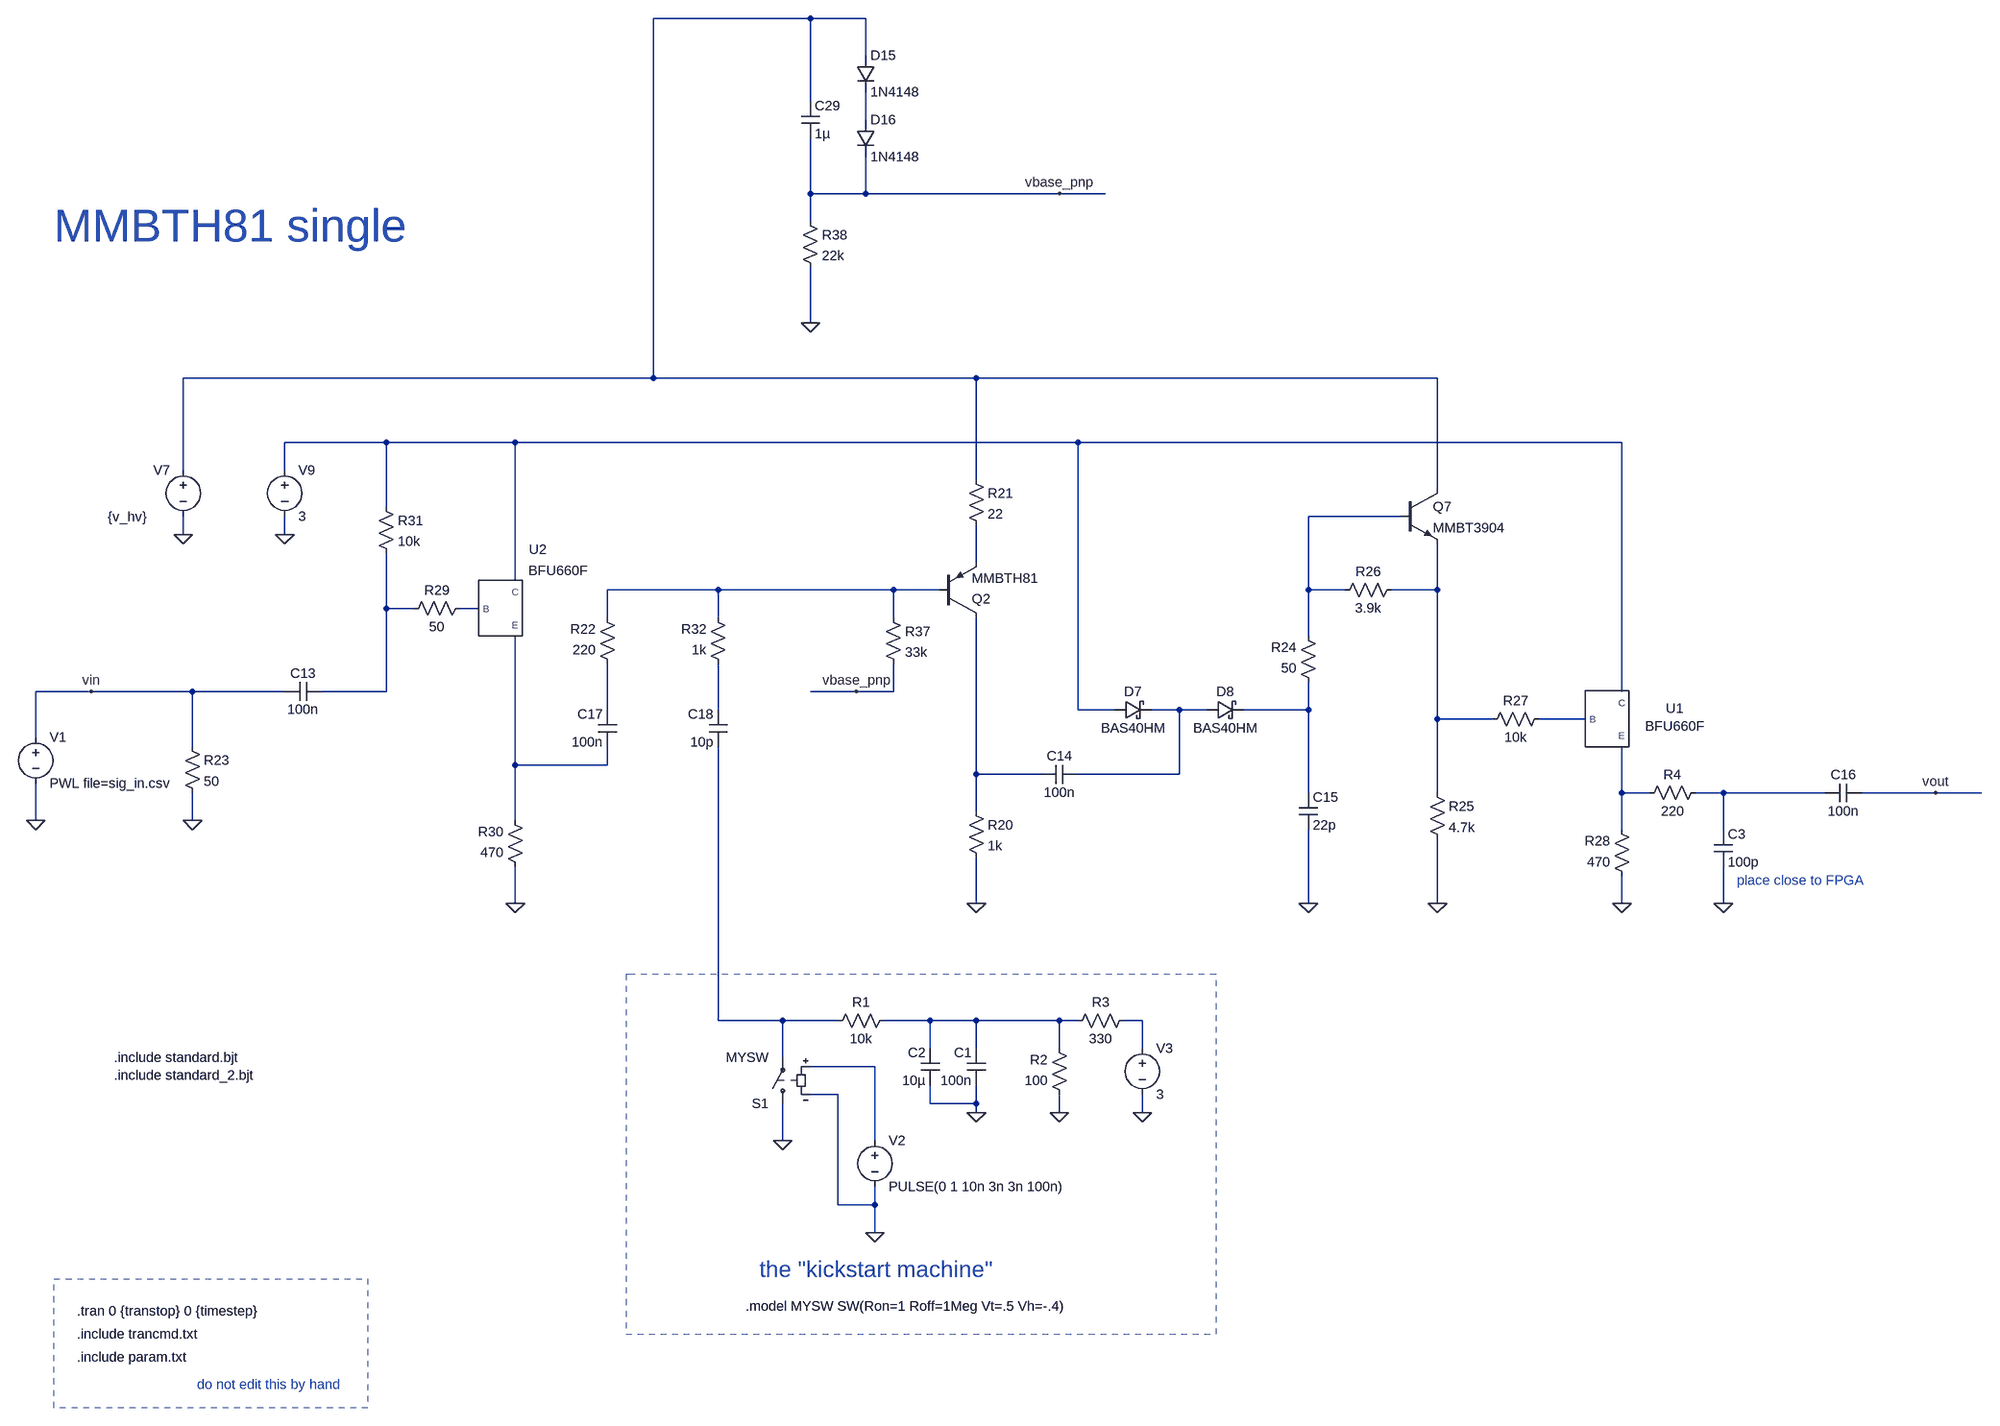
[diagram p0: schematic h81_kickstart_morelinear.asc]
h81_kickstart_morelinear.asc, the LTspice schematic file:
Version 4
SHEET 1 25452 10420
WIRE 19504 5040 19232 5040
WIRE 19600 5040 19504 5040
WIRE 19600 5104 19600 5040
WIRE 19504 5184 19504 5040
WIRE 19600 5216 19600 5168
WIRE 19504 5344 19504 5248
WIRE 19600 5344 19600 5280
WIRE 19600 5344 19504 5344
WIRE 19936 5344 19600 5344
WIRE 20016 5344 19936 5344
WIRE 19504 5392 19504 5344
WIRE 19504 5568 19504 5472
WIRE 19232 5664 19232 5040
WIRE 19232 5664 18416 5664
WIRE 19792 5664 19232 5664
WIRE 20592 5664 19792 5664
WIRE 18768 5776 18592 5776
WIRE 18992 5776 18768 5776
WIRE 19968 5776 18992 5776
WIRE 20912 5776 19968 5776
WIRE 18416 5824 18416 5664
WIRE 18592 5824 18592 5776
WIRE 19792 5840 19792 5664
WIRE 20592 5856 20592 5664
WIRE 18768 5888 18768 5776
WIRE 20528 5904 20368 5904
WIRE 18416 5936 18416 5904
WIRE 18592 5936 18592 5904
WIRE 19792 5984 19792 5920
WIRE 18992 6016 18992 5776
WIRE 19344 6032 19152 6032
WIRE 19648 6032 19344 6032
WIRE 19728 6032 19648 6032
WIRE 20368 6032 20368 5904
WIRE 20432 6032 20368 6032
WIRE 20592 6032 20592 5952
WIRE 20592 6032 20512 6032
WIRE 18768 6064 18768 5968
WIRE 18816 6064 18768 6064
WIRE 18928 6064 18896 6064
WIRE 19152 6080 19152 6032
WIRE 19344 6080 19344 6032
WIRE 19648 6080 19648 6032
WIRE 20368 6112 20368 6032
WIRE 18256 6208 18160 6208
WIRE 18432 6208 18256 6208
WIRE 18592 6208 18432 6208
WIRE 18768 6208 18768 6064
WIRE 18768 6208 18656 6208
WIRE 19584 6208 19504 6208
WIRE 19648 6208 19648 6160
WIRE 19648 6208 19584 6208
WIRE 20912 6208 20912 5776
WIRE 19152 6240 19152 6160
WIRE 19344 6240 19344 6160
WIRE 19968 6240 19968 5776
WIRE 20032 6240 19968 6240
WIRE 20144 6240 20096 6240
WIRE 20192 6240 20144 6240
WIRE 20368 6240 20368 6192
WIRE 20368 6240 20256 6240
WIRE 20592 6256 20592 6032
WIRE 20688 6256 20592 6256
WIRE 20848 6256 20768 6256
WIRE 18160 6288 18160 6208
WIRE 18432 6304 18432 6208
WIRE 18992 6336 18992 6112
WIRE 19152 6336 19152 6304
WIRE 19152 6336 18992 6336
WIRE 19792 6352 19792 6080
WIRE 19904 6352 19792 6352
WIRE 20144 6352 20144 6240
WIRE 20144 6352 19968 6352
WIRE 20368 6384 20368 6240
WIRE 20592 6384 20592 6256
WIRE 20912 6384 20912 6304
WIRE 20960 6384 20912 6384
WIRE 21088 6384 21040 6384
WIRE 21264 6384 21088 6384
WIRE 21456 6384 21328 6384
WIRE 21536 6384 21456 6384
WIRE 19792 6416 19792 6352
WIRE 18160 6432 18160 6368
WIRE 18432 6432 18432 6384
WIRE 18992 6432 18992 6336
WIRE 20912 6448 20912 6384
WIRE 21088 6448 21088 6384
WIRE 18992 6576 18992 6512
WIRE 19792 6576 19792 6496
WIRE 20368 6576 20368 6448
WIRE 20592 6576 20592 6464
WIRE 20912 6576 20912 6528
WIRE 21088 6576 21088 6512
WIRE 19344 6816 19344 6304
WIRE 19456 6816 19344 6816
WIRE 19552 6816 19456 6816
WIRE 19712 6816 19632 6816
WIRE 19792 6816 19712 6816
WIRE 19936 6816 19792 6816
WIRE 19968 6816 19936 6816
WIRE 20080 6816 20048 6816
WIRE 19712 6864 19712 6816
WIRE 19792 6864 19792 6816
WIRE 19936 6864 19936 6816
WIRE 20080 6864 20080 6816
WIRE 19456 6880 19456 6816
WIRE 19616 6896 19504 6896
WIRE 19552 6944 19504 6944
WIRE 19712 6960 19712 6928
WIRE 19792 6960 19792 6928
WIRE 19792 6960 19712 6960
WIRE 19792 6976 19792 6960
WIRE 19936 6976 19936 6944
WIRE 20080 6976 20080 6944
WIRE 19456 7024 19456 6960
WIRE 19616 7024 19616 6896
WIRE 19552 7136 19552 6944
WIRE 19616 7136 19616 7104
WIRE 19616 7136 19552 7136
WIRE 19616 7184 19616 7136
FLAG 19792 6576 0
FLAG 18432 6432 0
FLAG 20368 6576 0
FLAG 20592 6576 0
FLAG 20912 6576 0
FLAG 18592 5936 0
FLAG 18992 6576 0
FLAG 18416 5936 0
FLAG 19504 5568 0
FLAG 18256 6208 vin
FLAG 18160 6432 0
FLAG 21456 6384 vout
FLAG 19456 7024 0
FLAG 19616 7184 0
FLAG 20080 6976 0
FLAG 19936 6976 0
FLAG 19792 6976 0
FLAG 19584 6208 vbase_pnp
FLAG 19936 5344 vbase_pnp
FLAG 21088 6576 0
SYMBOL pnp 19728 6080 M180
SYMATTR InstName Q2
SYMATTR Value MMBTH81
SYMBOL res 19776 6400 R0
SYMATTR InstName R20
SYMATTR Value 1k
SYMBOL res 19776 5824 R0
SYMATTR InstName R21
SYMATTR Value 22
SYMBOL voltage 18416 5808 R0
WINDOW 123 0 0 Left 2
WINDOW 39 14 99 Left 2
WINDOW 0 -52 16 Left 2
WINDOW 3 -131 97 Left 2
SYMATTR InstName V7
SYMATTR Value {v_hv}
SYMBOL res 19168 6176 R180
WINDOW 0 36 76 Left 2
WINDOW 3 36 40 Left 2
SYMATTR InstName R22
SYMATTR Value 220
SYMBOL res 18416 6288 R0
SYMATTR InstName R23
SYMATTR Value 50
SYMBOL cap 18656 6192 R90
WINDOW 0 0 32 VBottom 2
WINDOW 3 32 32 VTop 2
SYMATTR InstName C13
SYMATTR Value 100n
SYMBOL cap 19968 6336 R90
WINDOW 0 0 32 VBottom 2
WINDOW 3 32 32 VTop 2
SYMATTR InstName C14
SYMATTR Value 100n
SYMBOL cap 20352 6384 R0
SYMATTR InstName C15
SYMATTR Value 22p
SYMBOL schottky 20032 6256 R270
WINDOW 3 0 32 VBottom 2
WINDOW 0 32 32 VTop 2
SYMATTR Value BAS40HM
SYMATTR InstName D7
SYMATTR Description Diode
SYMATTR Type diode
SYMBOL schottky 20192 6256 R270
WINDOW 3 0 32 VBottom 2
WINDOW 0 32 32 VTop 2
SYMATTR Value BAS40HM
SYMATTR InstName D8
SYMATTR Description Diode
SYMATTR Type diode
SYMBOL res 20384 6208 R180
WINDOW 0 36 76 Left 2
WINDOW 3 36 40 Left 2
SYMATTR InstName R24
SYMATTR Value 50
SYMBOL res 20576 6368 R0
SYMATTR InstName R25
SYMATTR Value 4.7k
SYMBOL npn 20528 5856 R0
SYMATTR InstName Q7
SYMATTR Value MMBT3904
SYMBOL res 20528 6016 R90
WINDOW 0 0 56 VBottom 2
WINDOW 3 32 56 VTop 2
SYMATTR InstName R26
SYMATTR Value 3.9k
SYMBOL res 20784 6240 R90
WINDOW 0 0 56 VBottom 2
WINDOW 3 32 56 VTop 2
SYMATTR InstName R27
SYMATTR Value 10k
SYMBOL res 20928 6544 R180
WINDOW 0 36 76 Left 2
WINDOW 3 36 40 Left 2
SYMATTR InstName R28
SYMATTR Value 470
SYMBOL cap 21328 6368 R90
WINDOW 0 0 32 VBottom 2
WINDOW 3 32 32 VTop 2
SYMATTR InstName C16
SYMATTR Value 100n
SYMBOL res 18912 6048 R90
WINDOW 0 0 56 VBottom 2
WINDOW 3 32 56 VTop 2
SYMATTR InstName R29
SYMATTR Value 50
SYMBOL res 19008 6528 R180
WINDOW 0 36 76 Left 2
WINDOW 3 36 40 Left 2
SYMATTR InstName R30
SYMATTR Value 470
SYMBOL voltage 18592 5808 R0
SYMATTR InstName V9
SYMATTR Value 3
SYMBOL cap 19168 6304 R180
WINDOW 0 24 56 Left 2
WINDOW 3 24 8 Left 2
SYMATTR InstName C17
SYMATTR Value 100n
SYMBOL res 18752 5872 R0
SYMATTR InstName R31
SYMATTR Value 10k
SYMBOL res 19360 6176 R180
WINDOW 0 36 76 Left 2
WINDOW 3 36 40 Left 2
SYMATTR InstName R32
SYMATTR Value 1k
SYMBOL cap 19360 6304 R180
WINDOW 0 24 56 Left 2
WINDOW 3 24 8 Left 2
SYMATTR InstName C18
SYMATTR Value 10p
SYMBOL res 19632 6064 R0
SYMATTR InstName R37
SYMATTR Value 33k
SYMBOL diode 19584 5104 R0
SYMATTR InstName D15
SYMATTR Value 1N4148
SYMBOL diode 19584 5216 R0
SYMATTR InstName D16
SYMATTR Value 1N4148
SYMBOL cap 19488 5184 R0
SYMATTR InstName C29
SYMATTR Value 1µ
SYMBOL res 19488 5376 R0
SYMATTR InstName R38
SYMATTR Value 22k
SYMBOL voltage 18160 6272 R0
WINDOW 39 0 0 Left 0
SYMATTR InstName V1
SYMATTR Value PWL file=sig_in.csv
SYMBOL sw 19456 6976 R180
SYMATTR InstName S1
SYMATTR Value MYSW
SYMBOL voltage 19616 7008 R0
WINDOW 123 0 0 Left 0
WINDOW 39 0 0 Left 0
SYMATTR InstName V2
SYMATTR Value PULSE(0 1 10n 3n 3n 100n)
SYMBOL res 19648 6800 R90
WINDOW 0 0 56 VBottom 2
WINDOW 3 32 56 VTop 2
SYMATTR InstName R1
SYMATTR Value 10k
SYMBOL voltage 20080 6848 R0
SYMATTR InstName V3
SYMATTR Value 3
SYMBOL res 19952 6960 R180
WINDOW 0 36 76 Left 2
WINDOW 3 36 40 Left 2
SYMATTR InstName R2
SYMATTR Value 100
SYMBOL res 19952 6832 R270
WINDOW 0 32 56 VTop 2
WINDOW 3 0 56 VBottom 2
SYMATTR InstName R3
SYMATTR Value 330
SYMBOL cap 19808 6928 R180
WINDOW 0 24 56 Left 2
WINDOW 3 24 8 Left 2
SYMATTR InstName C1
SYMATTR Value 100n
SYMBOL cap 19728 6928 R180
WINDOW 0 24 56 Left 2
WINDOW 3 24 8 Left 2
SYMATTR InstName C2
SYMATTR Value 10µ
SYMBOL BFU660F 20880 6256 R0
SYMATTR InstName U1
SYMBOL BFU660F 18960 6064 R0
WINDOW 0 71 -87 Bottom 2
WINDOW 3 107 -81 Top 2
SYMATTR InstName U2
SYMBOL res 21056 6368 R90
WINDOW 0 0 56 VBottom 2
WINDOW 3 32 56 VTop 2
SYMATTR InstName R4
SYMATTR Value 220
SYMBOL cap 21072 6448 R0
SYMATTR InstName C3
SYMATTR Value 100p
TEXT 18296 6880 Left 2 !.include standard.bjt\n.include standard_2.bjt
TEXT 19392 7312 Left 2 !.model MYSW SW(Ron=1 Roff=1Meg Vt=.5 Vh=-.4)
TEXT 18192 5400 Left 6 ;MMBTH81 single
TEXT 18232 7320 Left 2 !.tran 0 {transtop} 0 {timestep}
TEXT 18232 7400 Left 2 !.include param.txt
TEXT 18232 7360 Left 2 !.include trancmd.txt
TEXT 18440 7448 Left 2 ;do not edit this by hand
TEXT 19416 7248 Left 4 ;the "kickstart machine"
TEXT 21112 6536 Left 2 ;place close to FPGA
LINE Normal 20208 6736 19200 6736 2
LINE Normal 20208 7360 20208 6736 2
LINE Normal 19184 7360 20208 7360 2
LINE Normal 19184 6736 19184 7360 2
LINE Normal 19200 6736 19184 6736 2
LINE Normal 19264 6736 19264 6736 2
LINE Normal 19264 6736 19264 6736 2
RECTANGLE Normal 18736 7488 18192 7264 2

The netlist it stands for:
* h81_kickstart_morelinear.asc
Q2 N016 N006 N005 0 MMBTH81
R20 N016 0 1k
R21 N001 N005 22
V7 N001 0 {v_hv}
R22 N010 N006 220
R23 vin 0 50
C13 N008 vin 100n
C14 N012 N016 100n
C15 N013 0 22p
D7 N003 N012 BAS40HM
D8 N012 N013 BAS40HM
R24 N013 N004 50
R25 N007 0 4.7k
Q7 N001 N004 N007 0 MMBT3904
R26 N007 N004 3.9k
R27 N014 N007 10k
R28 0 N017 470
C16 vout N018 100n
R29 N009 N008 50
R30 0 N015 470
V9 N003 0 3
C17 N015 N010 100n
R31 N003 N008 10k
R32 N011 N006 1k
C18 N019 N011 10p
R37 N006 vbase_pnp 33k
D15 N001 N002 1N4148
D16 N002 vbase_pnp 1N4148
C29 N001 vbase_pnp 1µ
R38 vbase_pnp 0 22k
V1 vin 0 PWL file=sig_in.csv
S1 0 N019 N022 0 MYSW
V2 N022 0 PULSE(0 1 10n 3n 3n 100n)
R1 N020 N019 10k
V3 N021 0 3
R2 0 N020 100
R3 N020 N021 330
C1 0 N020 100n
C2 0 N020 10µ
XU1 N003 N014 N017 BFU660F  ; pins C B E
XU2 N003 N009 N015 BFU660F  ; pins C B E
R4 N018 N017 220
C3 N018 0 100p
.model D D
.lib standard.dio
.model NPN NPN
.model PNP PNP
.lib standard.bjt
.include standard.bjt
.include standard_2.bjt
.model MYSW SW(Ron=1 Roff=1Meg Vt=.5 Vh=-.4)
* MMBTH81 single
.tran 0 {transtop} 0 {timestep}
.include param.txt
.include trancmd.txt
* do not edit this by hand
* the "kickstart machine"
* place close to FPGA
.lib BFU660F.txt
.backanno
.end